# Altium schematic sheet phone.SchDoc
size A4; SheetNumber: 1; SheetTotal: 1
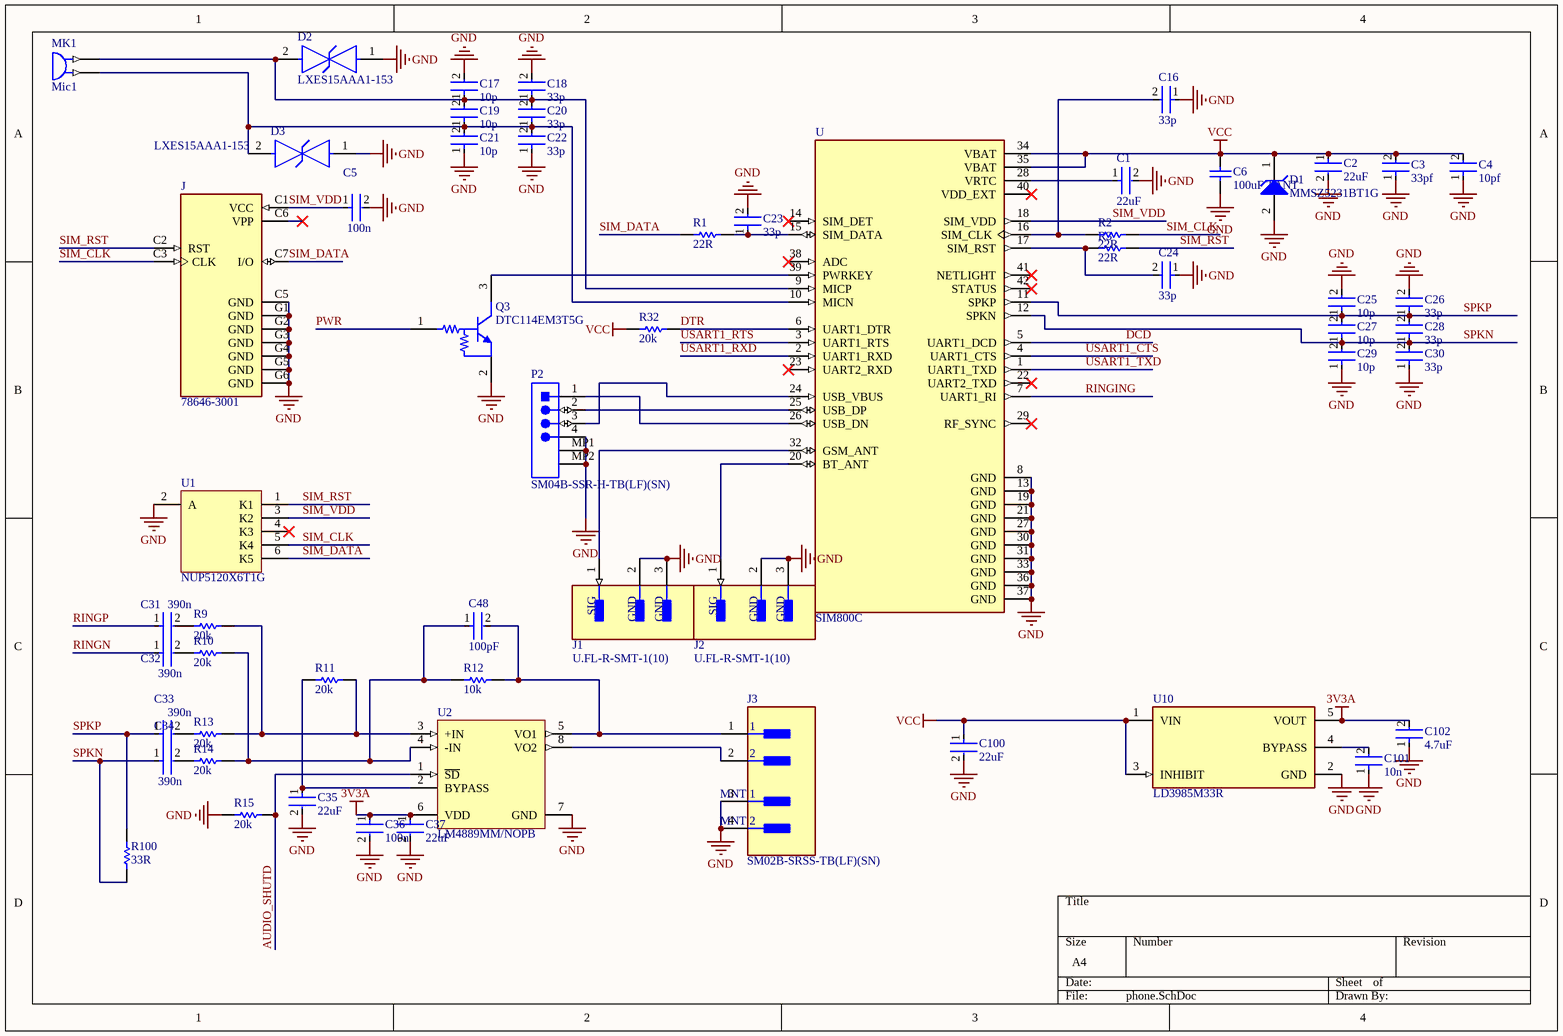
[diagram p0: phone.SchDoc]

## Parts
C1  22uF  [FP-GRM21B-0_15-MFG]
C2  22uF  [FP-GRM21B-0_15-MFG]
C3  33pf  [FP-GRM155-0_05-IPC_A]
C4  10pf  [FP-GRM155-0_05-IPC_A]
C5  100n  [FP-GRM155-0_05-IPC_A]
C6  value 100uF TANT  [CAPMP3525X20N]  (hidden comment: Capacitor)
C16  33p  [FP-GRM155-0_05-IPC_A]
C17  10p  [FP-GRM155-0_05-IPC_A]
C18  33p  [FP-GRM155-0_05-IPC_A]
C19  10p  [FP-GRM155-0_05-IPC_A]
C20  33p  [FP-GRM155-0_05-IPC_A]
C21  10p  [FP-GRM155-0_05-IPC_A]
C22  33p  [FP-GRM155-0_05-IPC_A]
C23  33p  [FP-GRM155-0_05-IPC_A]
C24  33p  [FP-GRM155-0_05-IPC_A]
C25  10p  [FP-GRM155-0_05-IPC_A]
C26  33p  [FP-GRM155-0_05-IPC_A]
C27  10p  [FP-GRM155-0_05-IPC_A]
C28  33p  [FP-GRM155-0_05-IPC_A]
C29  10p  [FP-GRM155-0_05-IPC_A]
C30  33p  [FP-GRM155-0_05-IPC_A]
C31  390n  [FP-GRM155-0_05-IPC_A]
C32  390n  [FP-GRM155-0_05-IPC_A]
C33  390n  [FP-GRM155-0_05-IPC_A]
C34  390n  [FP-GRM155-0_05-IPC_A]
C35  22uF  [FP-GRM21B-0_15-MFG]
C36  100n  [FP-GRM155-0_05-IPC_A]
C37  22uF  [FP-GRM21B-0_15-MFG]
C48  100pF  [FP-GRM155-0_05-IPC_A]
C100  22uF  [FP-GRM21B-0_15-MFG]
C101  10n  [FP-GRM155-0_05-IPC_A]
C102  4.7uF  [FP-GRM188-0_1-e0_2_0_55-IPC_A]
D1  MMSZ5231BT1G  [ONSC-SOD-123-2-425-04_V]
D2  LXES15AAA1-153  [FP-LXES15-MFG]
D3  LXES15AAA1-153  [FP-LXES15-MFG]
J  78646-3001  [MOLEX_78646-3001]
J1  U.FL-R-SMT-1(10)  [FP-U_FL-R-SMT-1_10-MFG]
J2  U.FL-R-SMT-1(10)  [FP-U_FL-R-SMT-1_10-MFG]
J3  SM02B-SRSS-TB(LF)(SN)  [FP-SM02B-SRSS-TB_LF_SN-0]
MK1  Mic1  [4015]
P2  SM04B-SSR-H-TB(LF)(SN)  [JST-SM04B-SSR-H-TB_V]
Q3  DTC114EM3T5G  [ONSC-SOT-723-3-631AA-01_V]
R1  22R  [RESC1005X40X25NL05T10]
R2  22R  [RESC1005X40X25NL05T10]
R3  22R  [RESC1005X40X25NL05T10]
R9  20k  [RESC1005X40X25NL05T10]
R10  20k  [RESC1005X40X25NL05T10]
R11  20k  [RESC1005X40X25NL05T10]
R12  10k  [RESC1005X40X25NL05T10]
R13  20k  [RESC1005X40X25NL05T10]
R14  20k  [RESC1005X40X25NL05T10]
R15  20k  [RESC1005X40X25NL05T10]
R32  20k  [RESC1005X40X25NL05T10]
R100  33R  [RESC1005X40X25NL05T10]
U  SIM800C  [LCC110P1570X1760X250-42N-NEW]
U1  NUP5120X6T1G  [ONSC-SOT-563-6-463A-01_V]
U2  LM4889MM/NOPB  [DGK0008A_L]
U10  LD3985M33R  [FP-SOT23-5L-7049676-MFG]

## Nets
3V3A: C36.1 C37.1 C102.2 U2.6(VDD) U10.5(VOUT)
GND: C1.2 C2.2 C3.1 C4.1 C5.2 C6.2 C16.1 C17.2 C18.2 C21.1 C22.1 C23.2 C24.1 C25.2 C26.2 C29.1 C30.1 C35.2 C36.2 C37.2 C100.2 C101.1 C102.1 D1.2(A) D2.1 D3.1 J.C5(GND) J.G1(GND) J.G2(GND) J.G3(GND) J.G4(GND) J.G5(GND) J.G6(GND) J1.2(GND) J1.3(GND) J2.2(GND) J2.3(GND) J3.3(MNT_1) J3.4(MNT_2) P2.4 P2.MP1 P2.MP2 Q3.2(E) R15.1 U.8(GND) U.13(GND) U.19(GND) U.21(GND) U.27(GND) U.30(GND) U.31(GND) U.33(GND) U.36(GND) U.37(GND) U1.2(A) U2.7(GND) U10.2(GND)
VCC: C2.1 C3.2 C4.2 C6.1 C100.1 D1.1(K) R32.1 U.34(VBAT) U.35(VBAT) U10.1(VIN) U10.3(INHIBIT)
AUDIO_SHUTD: R15.2 U2.1(~{SD})
DCD: U.5(UART1_DCD)
DTR: R32.2 U.6(UART1_DTR)
PWR: Q3.1(B)
RINGING: U.7(UART1_RI)
RINGN: C32.1
RINGP: C31.1
SIM_CLK: J.C3(CLK) R2.2 U1.5(K4)
SIM_DATA: J.C7(I/O) R1.1 U1.6(K5)
SIM_RST: J.C2(RST) R3.2 U1.1(K1)
SIM_VDD: C5.1 J.C1(VCC) U.18(SIM_VDD) U1.3(K2)
SPKN: C27.1 C28.1 C29.2 C30.2 C34.1 R100.1 U.12(SPKN)
SPKP: C25.1 C26.1 C27.2 C28.2 C33.1 R100.2 U.11(SPKP)
USART1_CTS: U.4(UART1_CTS)
USART1_RTS: U.3(UART1_RTS)
USART1_RXD: U.2(UART1_RXD)
USART1_TXD: U.1(UART1_TXD)
NetC1_1: C1.1 U.28(VRTC)
NetC16_2: C16.2 R2.1 U.16(SIM_CLK)
NetC17_1: C17.1 C18.1 C19.2 C20.2 D2.2 MK1.1 U.9(MICP)
NetC19_1: C19.1 C20.1 C21.2 C22.2 D3.2 MK1.2 U.10(MICN)
NetC23_1: C23.1 R1.2 U.15(SIM_DATA)
NetC24_2: C24.2 R3.1 U.17(SIM_RST)
NetC31_2: C31.2 R9.1
NetC32_2: C32.2 R10.1
NetC33_2: C33.2 R13.1
NetC34_2: C34.2 R14.1
NetC35_1: C35.1 R11.1 U2.2(BYPASS)
NetC48_1: C48.1 R10.2 R12.1 R14.2 U2.4(-IN)
NetC48_2: C48.2 J3.1 R12.2 U2.5(VO1)
NetC101_2: C101.2 U10.4(BYPASS)
NetJ1_1: J1.1(SIG) U.32(GSM_ANT)
NetJ2_1: J2.1(SIG) U.20(BT_ANT)
NetJ3_2: J3.2 U2.8(VO2)
NetP2_1: P2.1 U.26(USB_DN)
NetP2_2: P2.2 U.25(USB_DP)
NetP2_3: P2.3 U.24(USB_VBUS)
NetQ3_3: Q3.3(C) U.39(PWRKEY)
NetR9_2: R9.2 R11.2 R13.2 U2.3(+IN)

Not connected (* = marked no-connect by the designer): J C6(VPP)*; U 14(SIM_DET)* 22(UART2_TXD)* 23(UART2_RXD)* 29(RF_SYNC)* 38(ADC)* 40(VDD_EXT)* 41(NETLIGHT)* 42(STATUS)*; U1 4(K3)*

## Library data of the parts
C1 C2 C35 C37 C100 = CMP-2007-03385-2: Chip Multilayer Ceramic Capacitors for General Purpose, 0805, 22uF, X5R, 15%, 20%, 6.3V; Material: Ceramic; Max Operating Temperature: 85°C; Voltage: 6.3V; Min Operating Temperature: -55°C; Case/Package: 0805; Thickness: 0.053inch; Dielectric: X5R; Packaging: Tape and Reel; Depth: 1.25mm; Termination: SMD/SMT; Voltage Rating (DC): 6.3V; Radiation Hardening: No; Tolerance: 20%; Mount: Surface Mount; Lead Free: Lead Free; Package Quantity: 1; REACH SVHC: No SVHC; Voltage Rating: 6.3V; Capacitance: 22uF; Length: 2mm; Case Code (Imperial): 0805; Case Code (Metric): 2012; Width: 0.049inch; Height: 1.25mm
C3-C5 C16-C34 C36 C48 C101 = CMP-2008-04369-2: Chip Multilayer Ceramic Capacitors for General Purpose, 0402, 470pF, C0G, 30ppm/°C, 5%, 50V; Insulation Resistance: 10GR; Depth: 0.5mm; Voltage Rating: 50V; Packaging: Tape and Reel; Material: Ceramic; Lead Free: Lead Free; Max Operating Temperature: 125°C; Length: 1mm; Min Operating Temperature: -55°C; Height: 0.5mm; Width: 0.5mm; Thickness: 0.022inch; Voltage: 50V; Termination: SMD/SMT; Dielectric Material: Ceramic; REACH SVHC: No SVHC; Voltage Rating (DC): 50V; Package Quantity: 1; Dielectric: C0G; Radiation Hardening: No; Mount: Surface Mount; Case/Package: 0402; Number of Pins: 2; Tolerance: 5%; Temperature Coefficient: 30ppm/°C; Case Code (Metric): 1005; Capacitance: 470pF; Case Code (Imperial): 0402
C6 = Capacitor: SimulationGenericComponent: True
C102 = CMP-2006-02792-2: Chip Multilayer Ceramic Capacitors for General Purpose, 0603, 10uF, X5R, 15%, 20%, 6.3V; Packaging: Tape and Reel; Voltage Rating (DC): 6.3V; Width: 0.031inch; Termination: SMD/SMT; Dielectric: X5R; Package Quantity: 4000; Voltage Rating: 6.3V; Capacitance: 10uF; Case/Package: 0603; Min Operating Temperature: -55°C; Voltage: 6.3V; Length: 1.6mm; Thickness: 0.035inch; Lead Free: Lead Free; Depth: 0.8mm; Case Code (Imperial): 0603; Max Operating Temperature: 85°C; Material: Ceramic; Height: 0.8mm; Tolerance: 20%; Mount: Surface Mount; REACH SVHC: No SVHC; Radiation Hardening: No; Case Code (Metric): 1608
D1 = CMP-1060-00573-1: Zener Voltage Regulator, 500 mW, 2-Pin SOD-123, Pb-Free, Tape and Reel; Manufacturer: On Semiconductor; P Max (W): 0.5; VZ Typ (V): 5.1; PackageVersion: Rev. G, 10/2009; Mounting Technology: Surface Mount; ComponentLink2Description: Datasheet; ComponentLink3URL: http://www.onsemi.com/pub_link/Collateral/425-04.PDF; PackageDescription: 2-Pin SOD, Body 1.6 x 2.69 mm; Packing: Tape and Reel; ComponentLink2URL: http://www.onsemi.com/pub_link/Collateral/MMSZ5221BT1-D.PDF; ComponentLink1URL: http://www.onsemi.com/; PartNumber: MMSZ5231BT1G; PackageReference: SOD-123-2-425-04; RoHS: Pb-Free; ComponentLink1Description: Manufacturer URL; ComponentLink3Description: Package Specification; DatasheetVersion: Rev. 12
D2 D3 = CMP-06195-000025-1: TVS DIODE 4V 1005; Power Line Protection: No; Number of Bidirectional Channels: 1; Resistor Type: Zener; Case/Package: 0402; Max Operating Temperature: 85°C; Case Code (Metric): 1005; Packaging: Tape and Reel; Min Operating Temperature: -40°C; Mount: Surface Mount; Reverse Standoff Voltage: 4V; Case Code (Imperial): 0402
J = 78646-3001: 6 Position Card Connector Micro SIM Surface Mount, Right Angle Gold; MF: Molex; Price: None; Availability: Unavailable; Package: None; MP: 78646-3001; Value: *; SnapEDA_Link: https://www.snapeda.com/parts/78646-3001/Molex/view-part/75189/?ref=snap
J1 J2 = CMP-2000-05152-3: CONN U.FL RCPT STR 50 OHM SMD; Max Frequency: 6GHz; Connector Type: Coaxial; Body Plating: Silver; Body Material: Bronze; Impedance: 50R; Dielectric Material: Polymer; Insulation Resistance: 500MR; Gender: Male; Packaging: Cut Tape; Length: 3mm; Package Quantity: 2500; Termination: Solder; Lead Free: Lead Free; Series: U.FL; Min Operating Temperature: -40°C; Fastening Type: Snap; Contact Material: Brass; Orientation: Straight; Wire/Cable Type: Coaxial; Frequency: 6GHz; Contact Plating: Gold; Depth: 3.1mm; Weight: 0.001764oz; Max Operating Temperature: 90°C; Radiation Hardening: No; REACH SVHC: No SVHC; Mount: Surface Mount; Housing Color: Beige
J3 = CMP-17439-000024-1: CONN HEADER SMD R/A 2POS 1MM; Current Rating: 700mA; Voltage Rating: 50V; Insulation Resistance: 100MR; Number of Contacts: 2; Contact Resistance: 40mR; Max Current Rating: 1A; Min Operating Temperature: -25°C; Housing Material: Polyamide; Flammability Rating: UL94 V-0; Lead Pitch: 1mm; REACH SVHC: No SVHC; Lead Free: Lead Free; Contact Finish - Mating: TIN; Packaging: Tape and Reel; Series: SR; Length: 4mm; Color: Natural; Housing Color: Beige; Number of Rows: 1; Insulation Color: Natural; Connector Type: Header; Contact Shape: Square; Depth: 4.95mm; Termination: Solder; Voltage Rating (AC): 50V; Max Operating Temperature: 85°C; Pitch: 1mm; Fastening Type: Pull; Number of Positions: 2; Contact Type: Male Pin; Material: Polyamide; Orientation: Right Angle; Mount: Surface Mount; Insulation Material: Nylon; Contact Plating: Copper; Max Voltage Rating (AC): 50V; Contact Material: Copper Alloy
MK1 = Mic1: Microphone; Published: 24-Mar-1999; LatestRevisionDate: 17-Jul-2002; LatestRevisionNote: Re-released for DXP Platform.; PackageReference: PIN2; Publisher: Altium Limited
P2 = CMP-2000-07079-1: SSR Connector, Pitch 1 mm, 1 x 4 Position, Height 2 mm, -20 to 85 degC, RoHS, Tape and Reel; Manufacturer: JST; Style/Orientation: Plug; Pitch: 1mm; No of Positions: 4; Datasheet URL: http://www.jst-mfg.com/product/pdf/eng/eSSR.pdf; Package Reference: SM04B-SSR-H-TB; Type: WiretoBoard; Package Description: SSR Connector, Pitch 1 mm, 1 x 4 Position, Height 2 mm; Datasheet Version: 11/2010; Mounting Technology: SurfaceMount; Termination: IDC; Manufacturer URL: http://www.jst.com/home2.html
Q3 = CMP-0630-00443-1: Digital Transistor (BRT), R1=10 kOhm, R2=10 kOhm, NPN Transistor, 3-Pin SOT-723, Pb-Free, Tape and Reel; Manufacturer: On Semiconductor; V(BR)CEO Min (V): 50; R1/R2 Typ: 1; IC Continuous (A): 0.1; hFE Min: 35; ComponentLink3Description: Package Specification; Packing: Tape and Reel; ComponentLink1Description: Manufacturer URL; DatasheetVersion: Rev. 5; PackageDescription: 3-Pin Small Outline Transistor, Body 1.2 x 0.8 mm, Pitch 0.4 mm; RoHS: TRUE; Mounting Technology: Surface Mount; ComponentLink2URL: http://www.onsemi.cn/pub_link/Collateral/DTC114E-D.PDF; ComponentLink2Description: Datasheet; ComponentLink1URL: http://www.onsemi.com/; Polarity: NPN; PackageVersion: Rev. D, 08/2009; PartNumber: DTC114EM3T5G; PackageReference: SOT-723-3-631AA-01; ComponentLink3URL: http://www.onsemi.com/pub_link/Collateral/631AA.PDF
R1-R3 R9-R15 R32 R100 = CMP-1011-00001-2: Manufacturer: Yageo / Phycomp; Part Number: RC0402JR-070RL
U = SIM800C: Module: GSM/Bluetooth; GPRS; 2G; 1800MHz, 900MHz; 85.6kbps; SMD; MF: Simcom; MP: SIM800C; Availability: Unavailable; Package: None; Value: *; Price: None; SnapEDA_Link: https://www.snapeda.com/parts/SIM800C/SIMcom%20Wireless%20solutions%20Co.%2CLtd/view-part/571323/?ref=snap
U1 = CMP-1063-00205-1: 5-Line Transient Voltage Suppressor Array, 6-Pin SOT-563, Pb-Free, Tape and Reel; Manufacturer: On Semiconductor; IR Max (uA): 0.5; VRWM Max (V): 5; PPK Max (W): 90; Direction: Unidirectional; V(BR) Min (V): 6.2; C Max (pF): 70; ComponentLink2Description: Datasheet; ComponentLink2URL: http://www.onsemi.com/pub_link/Collateral/NUP5120-D.PDF; ComponentLink3Description: Package Specification; Number of Lines: 5; Packing: Tape and Reel; ComponentLink1Description: Manufacturer URL; PackageDescription: 6-Pin Small Outline Transistor, Body 1.6 x 1.2 mm, Pitch 0.5 mm; ComponentLink1URL: http://www.onsemi.com/; PackageReference: SOT-563-6-463A-01; DatasheetVersion: Rev. 4; ComponentLink3URL: http://www.onsemi.cn/pub_link/Collateral/463A-01.PDF; Mounting Technology: Surface Mount; RoHS: Pb-Free; PartNumber: NUP5120X6T1G; PackageVersion: Rev. F, 04/2005
U2 = CMP-0057-00557-3: 1W Audio Power Amplifier, 8-pin Mini SOIC, Pb-Free; Manufacturer: Texas Instruments; PackageTopMarking: ZXTT*GA2; CompType: Audio IC; PowerWise: N; RoHS: Y; PackageReference: DGK0008A; Code_JEDEC: MO-187-AA; PackageDescription: MINI SOIC, .118 x .118 x .034in, 8 Lead, .0256in Pitch; ComponentLink1URL: http://www.ti.com/general/docs/lit/getliterature.tsp?genericPartNumber=LM4889&fileType=pdf; ComponentLink1Description: Datasheet URL; PinCount: 8
U10 = CMP-0244-00328-2: IC REG LINEAR 3.3V 150MA SOT23-5; Input Bias Current: 85uA; Output Type: Fixed; Max Input Voltage: 6V; Min Input Voltage: 2.5V; Output Voltage Accuracy: 2%; Quiescent Current: 150uA; Number of Regulators: 1; Min Current Limit: 300mA; Dropout Voltage: 60mV; Polarity: Positive; Min Operating Temperature: -40°C; Height: 1.3mm; Radiation Hardening: No; Package Quantity: 1; Number of Pins: 5; Output Current: 150mA; Width: 1.75mm; Length: 3mm; Mount: Surface Mount; Case/Package: SOT-23; Lead Free: Lead Free; Number of Outputs: 1; Max Operating Temperature: 125°C; Accuracy: 2%; Max Output Current: 150mA; Packaging: Tape and Reel; Output Voltage: 3.3V; Min Output Voltage: 3.3V